# Altium schematic sheet SensorsAndActuators.SchDoc: Title
size A4; Date: *******; ApprovedBy: *******; CheckedBy: None; Author: *******; CompanyName: *******; DrawnBy: Name; Engineer: *******; Organization: *******; Address1: *******; Address2: *******; Address3: *******; Address4: *******; DocumentNumber: Doc Num; Revision: *******; SheetNumber: 4; SheetTotal: 4; CurrentTime: *******; CurrentDate: *******; Time: *******; DocumentFullPathAndName: *******; DocumentName: *******; ModifiedDate: *******; ImagePath: *******; ProjectName: *******; Application_BuildNumber: *******
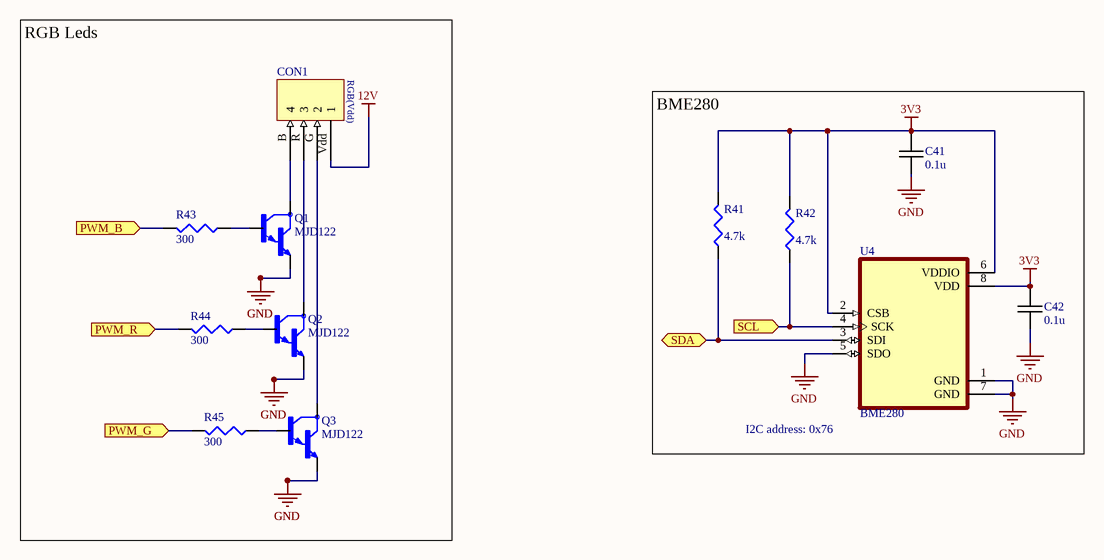
[diagram p0: SensorsAndActuators.SchDoc]

## Parts
C41  0.1u  [0603C-GENERIC]
C42  0.1u  [0603C-GENERIC]
CON1  (no value)  [PCBComponent_1]
Q1  MJD122  [MJD122]
Q2  MJD122  [MJD122]
Q3  MJD122  [MJD122]
R41  value 4.7k  [J1-0603]
R42  value 4.7k  [J1-0603]
R43  value 300  [J1-0603]
R44  value 300  [J1-0603]
R45  value 300  [J1-0603]
U4  BME280  [BME280]

## Blocks framed on the sheet
RGB Leds: CON1 Q1-Q3 R43-R45
BME280: C41 C42 R41 R42 U4

## Ports
PWM_B (in), PWM_G (in), PWM_R (in), SCL (in), SDA (bidir)

## Nets
3V3: C41.1 C42.1 R41.2 R42.2 U4.2(CSB) U4.6(VDDIO) U4.8(VDD)
12V: CON1.Vdd(1)
GND: C41.2 C42.2 Q1.3(E) Q2.3(E) Q3.3(E) U4.1(GND) U4.5(SDO) U4.7(GND)
PWM_B: R43.2 ; port PWM_B
PWM_G: R45.2 ; port PWM_G
PWM_R: R44.2 ; port PWM_R
SCL: R42.1 U4.4(SCK) ; port SCL
SDA: R41.1 U4.3(SDI) ; port SDA
NetCON1_B: CON1.B(4) Q1.4(C)
NetCON1_G: CON1.G(2) Q3.4(C)
NetCON1_R: CON1.R(3) Q2.4(C)
NetQ1_1: Q1.1(B) R43.1
NetQ2_1: Q2.1(B) R44.1
NetQ3_1: Q3.1(B) R45.1

## Notes on the sheet
- (near U4) I2C address: 0x76
- Title:
- Drawn By:
- Page Contents:
- Checked By:
- Size:
- Date:
- File:
- License:
- Email:
- A4
- Number:
- Time:
- Revision:
- Sheet
- Website:
- of
- (in symbol Component_1) RGB(Vdd)

## Library data of the parts
C41 C42 = C0603-GENERIC: GENERIC CAPACITOR NON POLARISED 0603
CON1 = Component_1
Q1-Q3 = MJD122: Bipolar _BJT_ Transistor NPN - Darlington 100V 8A 4MHz 1.75W Surface Mount DPAK; MF: ON Semiconductor; Availability: Unavailable; Package: TO-252 ON Semiconductor; MP: MJD122; Value: *; SnapEDA_Link: https://www.snapeda.com/parts/MJD122/ON%20Semiconductor/view-part/4705673/?ref=snap; Price: None
R41-R45 = Res3: Resistor; Published: 8-Jun-2000; LatestRevisionDate: 29-May-2009; LatestRevisionNote: IPC-7351 Footprint Added.; PackageReference: J1-0603; Publisher: Altium Limited; PackageDescription: Chip Resistor
U4 = BME280: Humidity Temperature Sensor 0 ~ 100% RH IÂ²C, SPI Â±3% 1s Surface Mount; MF: Bosch; Price: None; Package: LGA-8 Bosch; Value: *; MP: BME280; Availability: Unavailable; SnapEDA_Link: https://www.snapeda.com/parts/BME280/Bosch%20Sensortec/view-part/49769/?ref=snap